# Altium schematic sheet DAC_AFE_Mezzanine.SchDoc: Sayma RTM
size 420 x 297 mm; $$Internal___BlkDate: 23:43:25_12-13-18; $$Internal_NAME_PLACEHOLDER: a3sheet; $$Internal_Resolution: 00001mm; $$NotCommonProperty_@NAME: DAC_AFE_Mezzanine; $$NotCommonProperty_@PRINTORDER: 13; $$NotCommonProperty_@SHEET: 1; $$NotCommonProperty_@SHEETTOTAL: 16; $$NotCommonProperty_FORWARD_PCB: 0; CmpIndex: 91; Drawing Author: G.Kasprowicz; Drawing Number: Sayma RTM; Drawing Project: 8 channel SAWG; Drawing Revision: 2.0; SymIndex: 2227; Author: G.Kasprowicz; CompanyName: WUT ISE; DrawnBy: G.Kasprowicz; Organization: WUT ISE; Address1: PW ISE; Address2: Nowowiejska 15/19 00-665 Warsaw; Address3: gkasprow@gmail.com; DocumentNumber: 7; Revision: 1.0; SheetNumber: 7; SheetTotal: 18; ModifiedBy: -; CheckedDate: -; Title2: AFE mezzanine; DivGrp: WUT ISE; Designer: G.Kasprowicz; ModifiedDate: -; ProjectName: Sensor Box
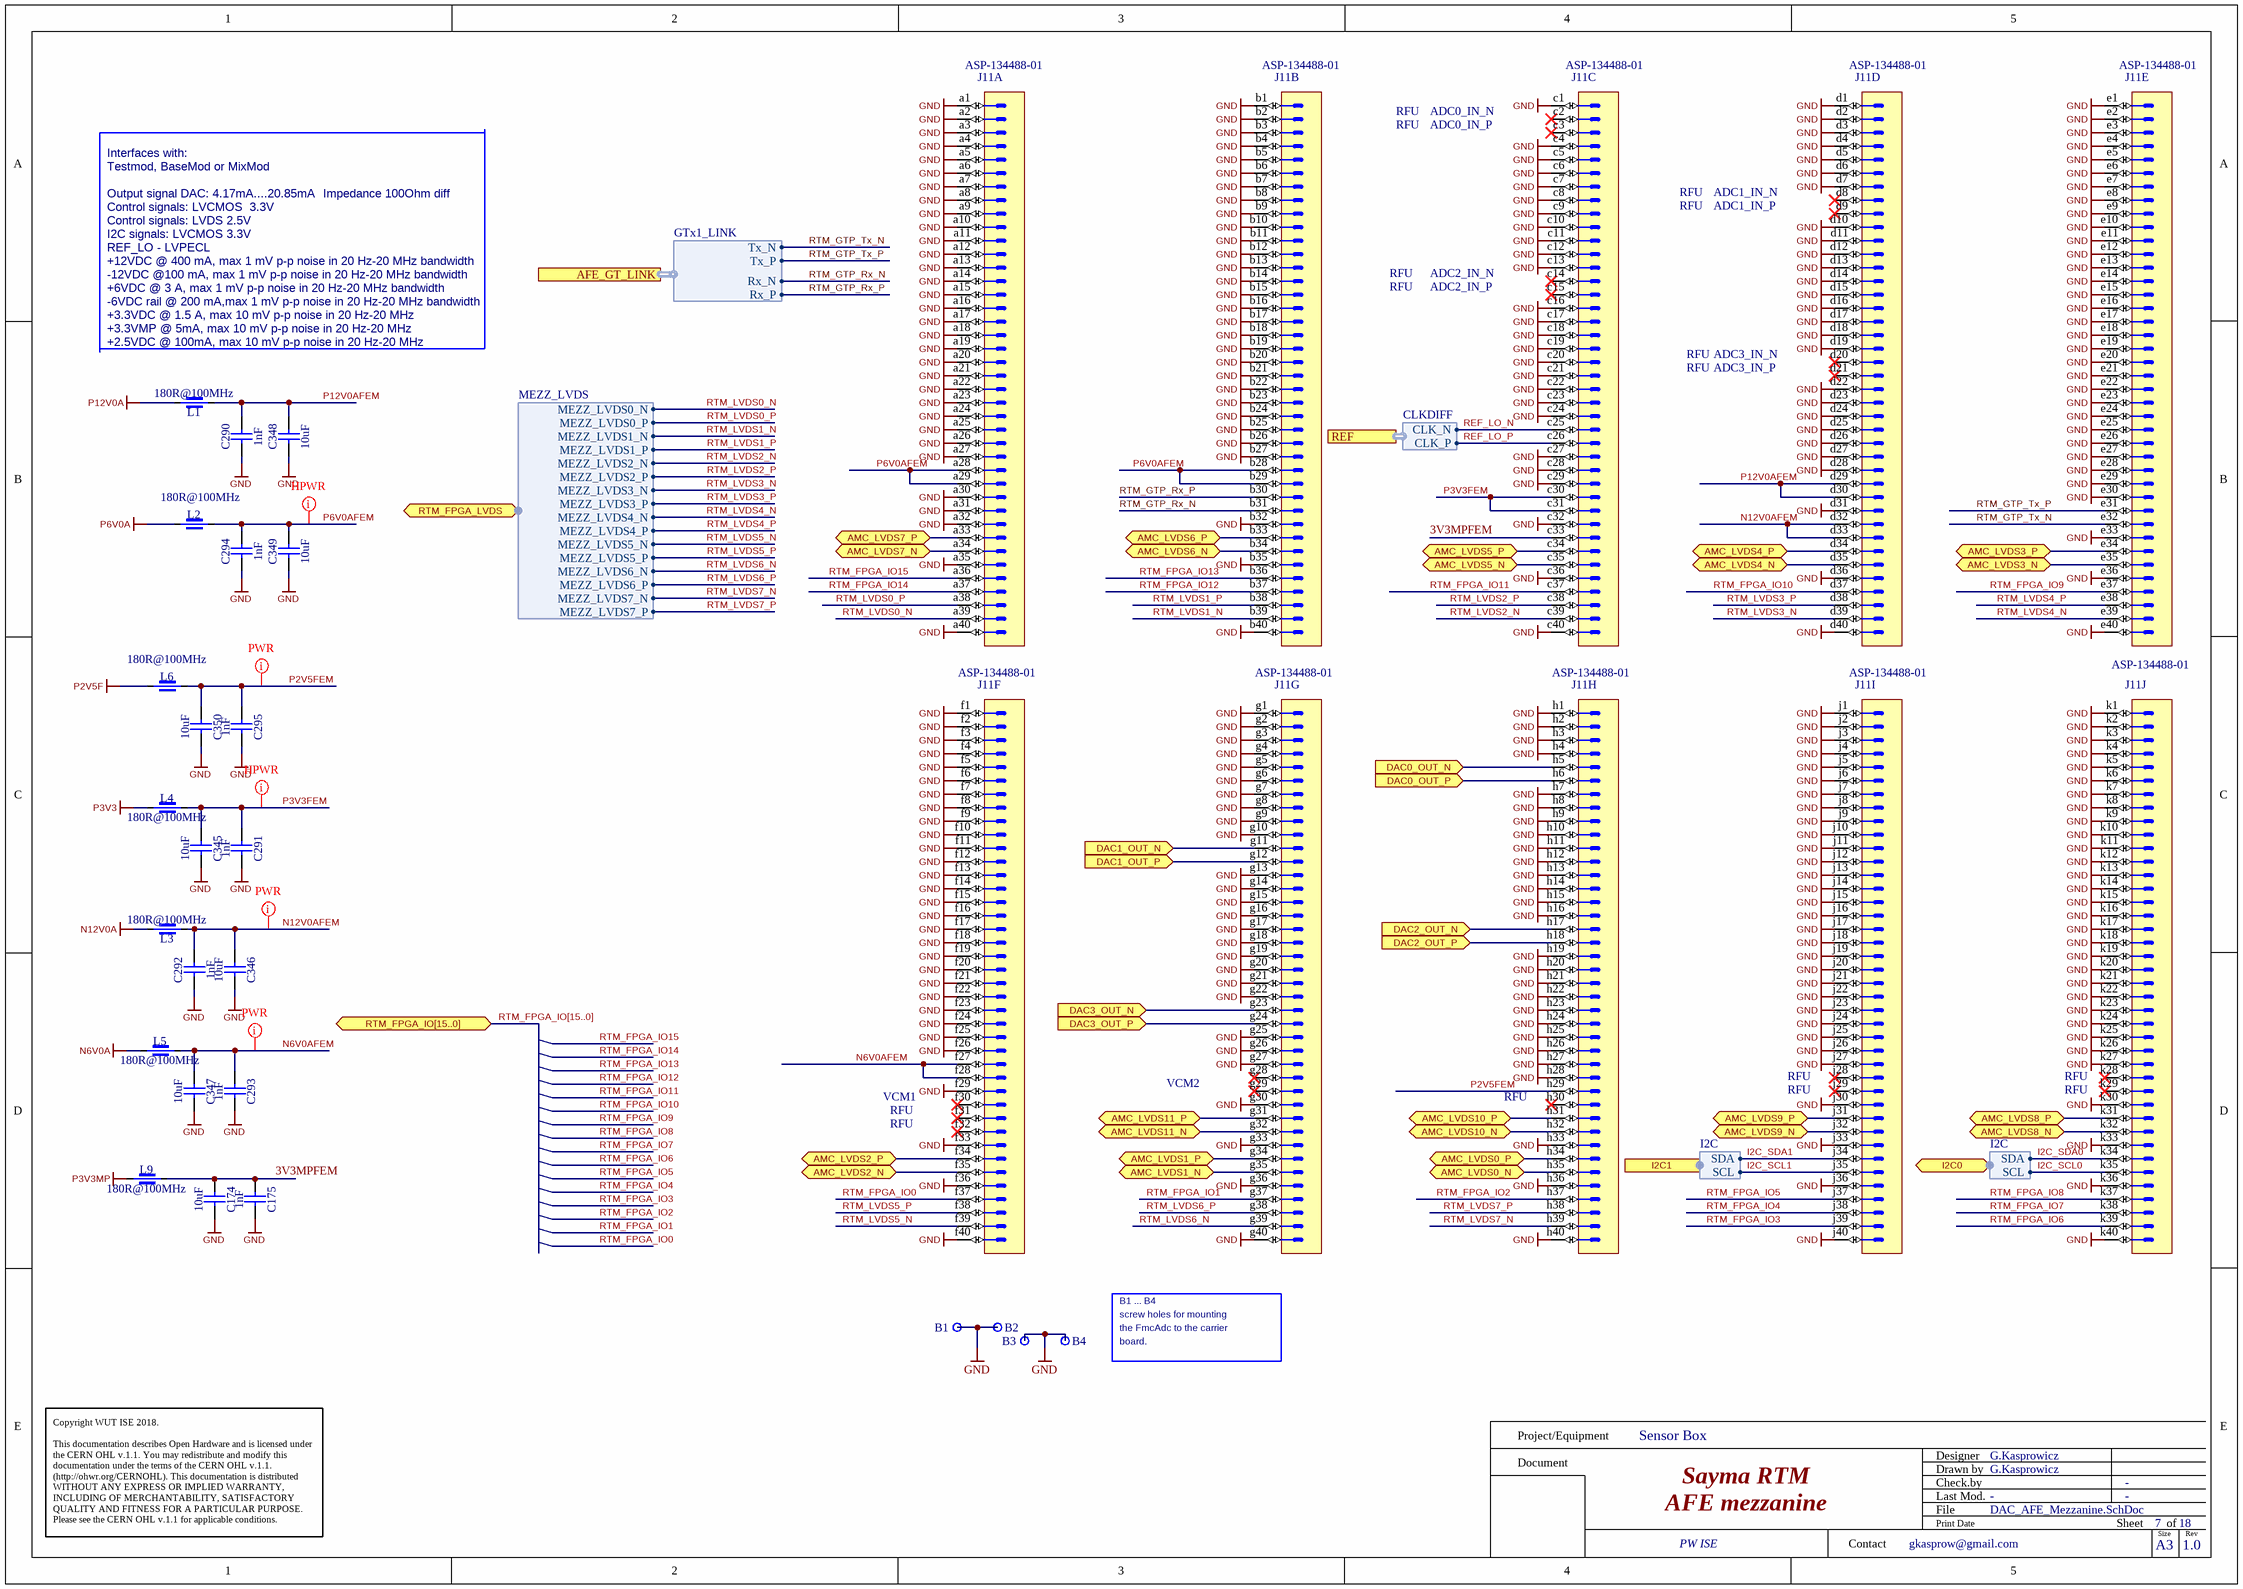
[diagram p0: DAC_AFE_Mezzanine.SchDoc]

## Parts
B1  Plated Hole  [MTG270_500]  (value not drawn)
B2  Plated Hole  [MTG270_500]  (value not drawn)
B3  Plated Hole  [MTG270_500]  (value not drawn)
B4  Plated Hole  [MTG270_500]  (value not drawn)
C174  10uF  [CAPC3216X180N]
C175  1nF  [CAPC1608X90N]
C290  1nF  [CAPC1608X90N]
C291  1nF  [CAPC1608X90N]
C292  1nF  [CAPC1608X90N]
C293  1nF  [CAPC1608X90N]
C294  1nF  [CAPC1608X90N]
C295  1nF  [CAPC1608X90N]
C345  10uF  [CAPC3216X180N]
C346  10uF  [CAPC3216X180N]
C347  10uF  [CAPC3216X180N]
C348  10uF  [CAPC3216X180N]
C349  10uF  [CAPC3216X180N]
C350  10uF  [CAPC3216X180N]
J11  Manufacturer Part Number: ASP-134488-01  [SAMTEC_ASP-134488-01]  (hidden comment: VITA 57)  (parts A,B,C,D,E,F,G,H,I,J of 10)
L1  180R@100MHz  [INDC4516X180N]
L2  180R@100MHz  [INDC4516X180N]
L3  180R@100MHz  [INDC4516X180N]
L4  180R@100MHz  [INDC4516X180N]
L5  180R@100MHz  [INDC4516X180N]
L6  180R@100MHz  [INDC4516X180N]
L9  180R@100MHz  [INDC4516X180N]

## Ports
AFE_GT_LINK (harness GTx1_LINK), AMC_LVDS0_N (bidir), AMC_LVDS0_P (bidir), AMC_LVDS1_N (bidir), AMC_LVDS1_P (bidir), AMC_LVDS2_N (bidir), AMC_LVDS2_P (bidir), AMC_LVDS3_N (bidir), AMC_LVDS3_P (bidir), AMC_LVDS4_N (bidir), AMC_LVDS4_P (bidir), AMC_LVDS5_N (bidir), AMC_LVDS5_P (bidir), AMC_LVDS6_N (bidir), AMC_LVDS6_P (bidir), AMC_LVDS7_N (bidir), AMC_LVDS7_P (bidir), AMC_LVDS8_N (bidir), AMC_LVDS8_P (bidir), AMC_LVDS9_N (bidir), AMC_LVDS9_P (bidir), AMC_LVDS10_N (bidir), AMC_LVDS10_P (bidir), AMC_LVDS11_N (bidir), AMC_LVDS11_P (bidir), DAC0_OUT_N (in), DAC0_OUT_P (in), DAC1_OUT_N (in), DAC1_OUT_P (in), DAC2_OUT_N (in), DAC2_OUT_P (in), DAC3_OUT_N (in), DAC3_OUT_P (in), I2C0 (bidir, harness I2C), I2C1 (harness I2C), REF (harness CLKDIFF), RTM_FPGA_IO[15..0] (bidir), RTM_FPGA_LVDS (bidir, harness MEZZ_LVDS)

## Harnesses
MEZZ_LVDS: MEZZ_LVDS0_N, MEZZ_LVDS0_P, MEZZ_LVDS1_N, MEZZ_LVDS1_P, MEZZ_LVDS2_N, MEZZ_LVDS2_P, MEZZ_LVDS3_N, MEZZ_LVDS3_P, MEZZ_LVDS4_N, MEZZ_LVDS4_P, MEZZ_LVDS5_N, MEZZ_LVDS5_P, MEZZ_LVDS6_N, MEZZ_LVDS6_P, MEZZ_LVDS7_N, MEZZ_LVDS7_P
I2C: SCL, SDA
CLKDIFF: CLK_N, CLK_P
GTx1_LINK: Rx_P, Rx_N, Tx_P, Tx_N

## Nets
GND: B1.1 B2.1 B3.1 B4.1 C174.1 C175.1 C290.2 C291.1 C292.1 C293.1 C294.1 C295.1 C345.1 C346.2 C347.1 C348.2 C349.1 C350.1 J11.a1 J11.a2 J11.a3 J11.a4 J11.a5 J11.a6 J11.a7 J11.a8 J11.a9 J11.a10 J11.a11 J11.a12 J11.a13 J11.a14 J11.a15 J11.a16 J11.a17 J11.a18 J11.a19 J11.a20 J11.a21 J11.a22 J11.a23 J11.a24 J11.a25 J11.a26 J11.a27 J11.a30 J11.a31 J11.a32 J11.a35 J11.a40 J11.b1 J11.b2 J11.b3 J11.b4 J11.b5 J11.b6 J11.b7 J11.b8 J11.b9 J11.b10 J11.b11 J11.b12 J11.b13 J11.b14 J11.b15 J11.b16 J11.b17 J11.b18 J11.b19 J11.b20 J11.b21 J11.b22 J11.b23 J11.b24 J11.b25 J11.b26 J11.b27 J11.b32 J11.b35 J11.b40 J11.c1 J11.c4 J11.c5 J11.c6 J11.c7 J11.c8 J11.c9 J11.c10 J11.c11 J11.c12 J11.c13 J11.c16 J11.c17 J11.c18 J11.c19 J11.c20 J11.c21 J11.c22 J11.c23 J11.c24 J11.c27 J11.c28 J11.c29 J11.c32 J11.c36 J11.c40 J11.d1 J11.d2 J11.d3 J11.d4 J11.d5 J11.d6 J11.d7 J11.d10 J11.d11 J11.d12 J11.d13 J11.d14 J11.d15 J11.d16 J11.d17 J11.d18 J11.d19 J11.d22 J11.d23 J11.d24 J11.d25 J11.d26 J11.d27 J11.d28 J11.d31 J11.d36 J11.d40 J11.e1 J11.e2 J11.e3 J11.e4 J11.e5 J11.e6 J11.e7 J11.e8 J11.e9 J11.e10 J11.e11 J11.e12 J11.e13 J11.e14 J11.e15 J11.e16 J11.e17 J11.e18 J11.e19 J11.e20 J11.e21 J11.e22 J11.e23 J11.e24 J11.e25 J11.e26 J11.e27 J11.e28 J11.e29 J11.e30 J11.e33 J11.e36 J11.e40 J11.f1 J11.f2 J11.f3 J11.f4 J11.f5 J11.f6 J11.f7 J11.f8 J11.f9 J11.f10 J11.f11 J11.f12 J11.f13 J11.f14 J11.f15 J11.f16 J11.f17 J11.f18 J11.f19 J11.f20 J11.f21 J11.f22 J11.f23 J11.f24 J11.f25 J11.f26 J11.f29 J11.f33 J11.f36 J11.f40 J11.g1 J11.g2 J11.g3 J11.g4 J11.g5 J11.g6 J11.g7 J11.g8 J11.g9 J11.g10 J11.g13 J11.g14 J11.g15 J11.g16 J11.g17 J11.g18 J11.g19 J11.g20 J11.g21 J11.g22 J11.g25 J11.g26 J11.g27 J11.g30 J11.g33 J11.g36 J11.g40 J11.h1 J11.h2 J11.h3 J11.h4 J11.h7 J11.h8 J11.h9 J11.h10 J11.h11 J11.h12 J11.h13 J11.h14 J11.h15 J11.h16 J11.h19 J11.h20 J11.h21 J11.h22 J11.h23 J11.h24 J11.h25 J11.h26 J11.h27 J11.h28 J11.h33 J11.h36 J11.h40 J11.j1 J11.j2 J11.j3 J11.j4 J11.j5 J11.j6 J11.j7 J11.j8 J11.j9 J11.j10 J11.j11 J11.j12 J11.j13 J11.j14 J11.j15 J11.j16 J11.j17 J11.j18 J11.j19 J11.j20 J11.j21 J11.j22 J11.j23 J11.j24 J11.j25 J11.j26 J11.j27 J11.j30 J11.j33 J11.j36 J11.j40 J11.k1 J11.k2 J11.k3 J11.k4 J11.k5 J11.k6 J11.k7 J11.k8 J11.k9 J11.k10 J11.k11 J11.k12 J11.k13 J11.k14 J11.k15 J11.k16 J11.k17 J11.k18 J11.k19 J11.k20 J11.k21 J11.k22 J11.k23 J11.k24 J11.k25 J11.k26 J11.k27 J11.k30 J11.k33 J11.k36 J11.k40
N6V0A: L5.2
N12V0A: L3.2
P2V5F: L6.2
P3V3: L4.2
P3V3MP: L9.2
P6V0A: L2.1
P12V0A: L1.1
3V3MPFEM: C174.2 C175.2 J11.c33 L9.1
AMC_LVDS0_N: J11.h35 ; port AMC_LVDS0_N
AMC_LVDS0_P: J11.h34 ; port AMC_LVDS0_P
AMC_LVDS1_N: J11.g35 ; port AMC_LVDS1_N
AMC_LVDS1_P: J11.g34 ; port AMC_LVDS1_P
AMC_LVDS2_N: J11.f35 ; port AMC_LVDS2_N
AMC_LVDS2_P: J11.f34 ; port AMC_LVDS2_P
AMC_LVDS3_N: J11.e35 ; port AMC_LVDS3_N
AMC_LVDS3_P: J11.e34 ; port AMC_LVDS3_P
AMC_LVDS4_N: J11.d35 ; port AMC_LVDS4_N
AMC_LVDS4_P: J11.d34 ; port AMC_LVDS4_P
AMC_LVDS5_N: J11.c35 ; port AMC_LVDS5_N
AMC_LVDS5_P: J11.c34 ; port AMC_LVDS5_P
AMC_LVDS6_N: J11.b34 ; port AMC_LVDS6_N
AMC_LVDS6_P: J11.b33 ; port AMC_LVDS6_P
AMC_LVDS7_N: J11.a34 ; port AMC_LVDS7_N
AMC_LVDS7_P: J11.a33 ; port AMC_LVDS7_P
AMC_LVDS8_N: J11.k32 ; port AMC_LVDS8_N
AMC_LVDS8_P: J11.k31 ; port AMC_LVDS8_P
AMC_LVDS9_N: J11.j32 ; port AMC_LVDS9_N
AMC_LVDS9_P: J11.j31 ; port AMC_LVDS9_P
AMC_LVDS10_N: J11.h32 ; port AMC_LVDS10_N
AMC_LVDS10_P: J11.h31 ; port AMC_LVDS10_P
AMC_LVDS11_N: J11.g32 ; port AMC_LVDS11_N
AMC_LVDS11_P: J11.g31 ; port AMC_LVDS11_P
DAC0_OUT_N: J11.h5 ; port DAC0_OUT_N
DAC0_OUT_P: J11.h6 ; port DAC0_OUT_P
DAC1_OUT_N: J11.g11 ; port DAC1_OUT_N
DAC1_OUT_P: J11.g12 ; port DAC1_OUT_P
DAC2_OUT_N: J11.h17 ; port DAC2_OUT_N
DAC2_OUT_P: J11.h18 ; port DAC2_OUT_P
DAC3_OUT_N: J11.g23 ; port DAC3_OUT_N
DAC3_OUT_P: J11.g24 ; port DAC3_OUT_P
I2C_SCL0: J11.k35 ; port I2C0.SCL
I2C_SCL1: J11.j35 ; port I2C1.SCL
I2C_SDA0: J11.k34 ; port I2C0.SDA
I2C_SDA1: J11.j34 ; port I2C1.SDA
N6V0AFEM: C293.2 C347.2 J11.f27 J11.f28 L5.1
N12V0AFEM: C292.2 C346.1 J11.d32 J11.d33 L3.1
P2V5FEM: C295.2 C350.2 J11.h29 L6.1
P3V3FEM: C291.2 C345.2 J11.c30 J11.c31 L4.1
P6V0AFEM: C294.2 C349.2 J11.a28 J11.a29 J11.b28 J11.b29 L2.2
P12V0AFEM: C290.1 C348.1 J11.d29 J11.d30 L1.2
REF_LO_N: J11.c25 ; port REF.CLK_N
REF_LO_P: J11.c26 ; port REF.CLK_P
RTM_FPGA_IO0: J11.f37
RTM_FPGA_IO1: J11.g37
RTM_FPGA_IO2: J11.h37
RTM_FPGA_IO3: J11.j39
RTM_FPGA_IO4: J11.j38
RTM_FPGA_IO5: J11.j37
RTM_FPGA_IO6: J11.k39
RTM_FPGA_IO7: J11.k38
RTM_FPGA_IO8: J11.k37
RTM_FPGA_IO9: J11.e37
RTM_FPGA_IO10: J11.d37
RTM_FPGA_IO11: J11.c37
RTM_FPGA_IO12: J11.b37
RTM_FPGA_IO13: J11.b36
RTM_FPGA_IO14: J11.a37
RTM_FPGA_IO15: J11.a36
RTM_GTP_Rx_N: J11.b31 ; port AFE_GT_LINK.Rx_N
RTM_GTP_Rx_P: J11.b30 ; port AFE_GT_LINK.Rx_P
RTM_GTP_Tx_N: J11.e32 ; port AFE_GT_LINK.Tx_N
RTM_GTP_Tx_P: J11.e31 ; port AFE_GT_LINK.Tx_P
RTM_LVDS0_N: J11.a39 ; port RTM_FPGA_LVDS.MEZZ_LVDS0_N
RTM_LVDS0_P: J11.a38 ; port RTM_FPGA_LVDS.MEZZ_LVDS0_P
RTM_LVDS1_N: J11.b39 ; port RTM_FPGA_LVDS.MEZZ_LVDS1_N
RTM_LVDS1_P: J11.b38 ; port RTM_FPGA_LVDS.MEZZ_LVDS1_P
RTM_LVDS2_N: J11.c39 ; port RTM_FPGA_LVDS.MEZZ_LVDS2_N
RTM_LVDS2_P: J11.c38 ; port RTM_FPGA_LVDS.MEZZ_LVDS2_P
RTM_LVDS3_N: J11.d39 ; port RTM_FPGA_LVDS.MEZZ_LVDS3_N
RTM_LVDS3_P: J11.d38 ; port RTM_FPGA_LVDS.MEZZ_LVDS3_P
RTM_LVDS4_N: J11.e39 ; port RTM_FPGA_LVDS.MEZZ_LVDS4_N
RTM_LVDS4_P: J11.e38 ; port RTM_FPGA_LVDS.MEZZ_LVDS4_P
RTM_LVDS5_N: J11.f39 ; port RTM_FPGA_LVDS.MEZZ_LVDS5_N
RTM_LVDS5_P: J11.f38 ; port RTM_FPGA_LVDS.MEZZ_LVDS5_P
RTM_LVDS6_N: J11.g39 ; port RTM_FPGA_LVDS.MEZZ_LVDS6_N
RTM_LVDS6_P: J11.g38 ; port RTM_FPGA_LVDS.MEZZ_LVDS6_P
RTM_LVDS7_N: J11.h39 ; port RTM_FPGA_LVDS.MEZZ_LVDS7_N
RTM_LVDS7_P: J11.h38 ; port RTM_FPGA_LVDS.MEZZ_LVDS7_P

Not connected (* = marked no-connect by the designer): J11 c2* c3* c14* c15* d8* d9* d20* d21* f30* f31* f32* g28* g29* h30* j28* j29* k28* k29*

## Buses and harness runs
bus RTM_FPGA_IO[15..0] = port RTM_FPGA_IO[15..0]

## Layout directives
net class HPWR: P3V3FEM, P6V0AFEM
net class PWR: N6V0AFEM, N12V0AFEM, P2V5FEM

## Notes on the sheet
- RFU
- ADC0_IN_N
- ADC0_IN_P
- Interfaces with:
- Testmod, BaseMod or MixMod
- Output signal DAC: 4.17mA....20.85mA
- Impedance 100Ohm diff
- I2C signals: LVCMOS 3.3V
- REF_LO - LVPECL
- Control signals: LVCMOS  3.3V
- +12VDC @ 400 mA, max 1 mV p-p noise in 20 Hz-20 MHz bandwidth
- Control signals: LVDS 2.5V
- ADC1_IN_N
- ADC1_IN_P
- +6VDC @ 3 A, max 1 mV p-p noise in 20 Hz-20 MHz bandwidth
- +3.3VMP @ 5mA, max 10 mV p-p noise in 20 Hz-20 MHz
- -12VDC @100 mA, max 1 mV p-p noise in 20 Hz-20 MHz bandwidth
- +3.3VDC @ 1.5 A, max 10 mV p-p noise in 20 Hz-20 MHz
- -6VDC rail @ 200 mA,max 1 mV p-p noise in 20 Hz-20 MHz bandwidth
- ADC2_IN_N
- ADC2_IN_P
- +2.5VDC @ 100mA, max 10 mV p-p noise in 20 Hz-20 MHz
- ADC3_IN_N
- ADC3_IN_P
- VCM1
- VCM2
- (near J11) RFU
- board.
- screw holes for mounting
- the FmcAdc to the carrier
- B1 ... B4
- Project/Equipment
- Document
- Designer
- Drawn by
- Check.by
- Copyright WUT ISE 2018.
  This documentation describes Open Hardware and is licensed under the CERN OHL v.1.1. You may redistribute and modify this documentation under the terms of the CERN OHL v.1.1. (http://ohwr.org/CERNOHL). This documentation is distributed WITHOUT ANY EXPRESS OR IMPLIED WARRANTY, INCLUDING OF MERCHANTABILITY, SATISFACTORY QUALITY AND FITNESS FOR A PARTICULAR PURPOSE. Please see the CERN OHL v.1.1 for applicable conditions.
- Contact
- File
- Last Mod.
- Print Date
- Sheet
- Size
- A3
- of
- Rev

## Library data of the parts
B1-B4 = PLATED_HOLE2.7_PAD5.0: Single Terminal Socket; Part Description: Plated Through Hole: Hole Dia.=2.7mm Pad Dia.=5.0mm; Mounted: No; Author: CERN DEM JMW; Component Kind: Standard (No BOM); Component Type: Standard (No BOM); ComponentHeight: 0mm; CreateDate: 27.09.2011; Family: Plated Hole; HelpURL: Undefined; LatestRevisionDate: 27.09.2011; PackageDescription: Plated Through Hole: Hole Dia.=2.7mm Pad Dia.=5.0mm; Part Number: PLATED_HOLE2.7_PAD5.0; Pin Count: 1; Sense: No; SMD: No; Socket: No; Status: None
C174 C345-C350 = CC1206_10uF_25V_10%_X7R: Non-polarised capacitor; Manufacturer: GENERIC; Manufacturer1 Part Number: C1206C106K4RACTU; Part Description: SMD Multilayer Chip Ceramic Capacitor; TC: X7R; Tolerance: ±10%; Voltage: 25V; Case: 1206; Manufacturer Part Number: CC1206_10uF_25V_10%_X7R; Manufacturer1 Example: KEMET; Part Number: CC1206_10UF_25V_10%_X7R; Pin Count: 2; SMD: Yes; Status: Preferred; Value: 10uF; Component Kind: Standard; Component Type: Standard; Mounted: Yes; Socket: No; Sense: No; Manufacturer1 ComponentHeight: 1.8mm; HelpURL: \\cern.ch\dfs\Applications\Altium\Datasheets\CC1206_X7R_KEMET.pdf; Author: CERN DEM JLC; CreateDate: 12.09.2012; LatestRevisionDate: 12.09.2012
C175 C290-C295 = CC0603_1NF_50V_5%_NP0: Non-polarised capacitor; Manufacturer: GENERIC; Manufacturer1 Part Number: CC0603JRNPO9BN102; Part Description: SMD Multilayer Chip Ceramic Capacitor; TC: C0G/NP0; Tolerance: ±5%; Voltage: 50V; Case: 0603; Manufacturer Part Number: CC0603_1NF_50V_5%_NP0; Manufacturer1 Example: YAGEO PHYCOMP; Part Number: CC0603_1NF_50V_5%_NP0; Pin Count: 2; SMD: Yes; Status: Preferred; Value: 1nF; Component Kind: Standard; Component Type: Standard; Mounted: Yes; Socket: No; Sense: No; Manufacturer1 ComponentHeight: 0.9mm; HelpURL: \\cern.ch\dfs\Applications\Altium\Datasheets\CC0805_NP0_PHYCOMP_16VTO50V.pdf; Author: CERN DEM JLC; CreateDate: 22.10.2012; LatestRevisionDate: 22.10.2012
J11 = SAMTEC_ASP-134488-01: Connector VITA 57, 400 Male contacts in 10 row abcdefghj; Manufacturer: SAMTEC; Part Description: 400 contacts (10 rows abcdefghj) Surface Mount Male Connector, VITA 57 (MC-HPC-10); PressFit: No; Author: CERN DEM JLC; Component Kind: Standard; Component Type: Standard; ComponentHeight: 6.1mm; CreateDate: 30.04.2009; Family: VITA 57; HelpURL: \\cern.ch\dfs\Applications\Altium\Datasheets\SAMTEC_ASP-134488-01.pdf; LatestRevisionDate: 17.08.2009; Mounted: Yes; Part Number: SAMTEC_ASP-134488-01; Pin Count: 400; SMD: Yes; Socket: No; Status: None; Sense: No
L1-L6 L9 = IND1806_MURATA_BLM41PG181SN1L: Manufacturer: MURATA; Part Description: SMD EMI Suppression Chip Ferrite Bead (BLM41P Series); Power: 3.5A; Resistance: 0.02R; Case: 1806; ComponentHeight: 1.8mm; Manufacturer Part Number: BLM41PG181SN1L; Part Number: IND1806_MURATA_BLM41PG181SN1L; Pin Count: 2; SMD: Yes; Value: 180R@100MHz; Component Kind: Standard; Component Type: Standard; Status: None; Mounted: Yes; Socket: No; Sense: No; HelpURL: \\cern.ch\dfs\Applications\Altium\Datasheets\IND1806_MURATA_BLM41P.pdf; Author: CERN DEM JLC; CreateDate: 26.06.2012; LatestRevisionDate: 26.06.2012